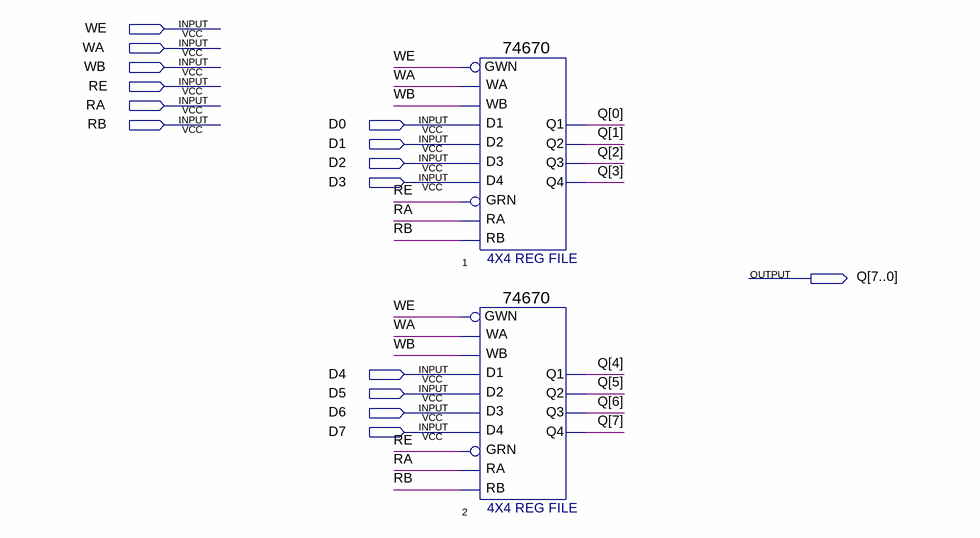
[diagram p0: schematic sheet]
// Quartus schematic 6702.bdf as structural Verilog: 2 symbols, 15 pins
module \6702  (
  input  WE,
  input  WA,
  input  WB,
  input  RE,
  input  RA,
  input  RB,
  input  D0,
  input  D1,
  input  D2,
  input  D3,
  input  D4,
  input  D5,
  input  D6,
  input  D7,
  output [7:0] Q
);

  \74670  u_1 (
    .WA(WA), .WB(WB), .D1(D0), .D2(D1), .D3(D2), .D4(D3), .GRN(RE), .RA(RA), .RB(RB), .GWN(WE), .Q4(Q[3]),
    .Q3(Q[2]), .Q2(Q[1]), .Q1(Q[0]));
  \74670  u_2 (
    .WA(WA), .WB(WB), .D1(D4), .D2(D5), .D3(D6), .D4(D7), .GRN(RE), .RA(RA), .RB(RB), .GWN(WE), .Q4(Q[7]),
    .Q3(Q[6]), .Q2(Q[5]), .Q1(Q[4]));
endmodule
